# Altium schematic sheet M3_Coral.SchDoc
size A3; SheetNumber: 3; SheetTotal: 5
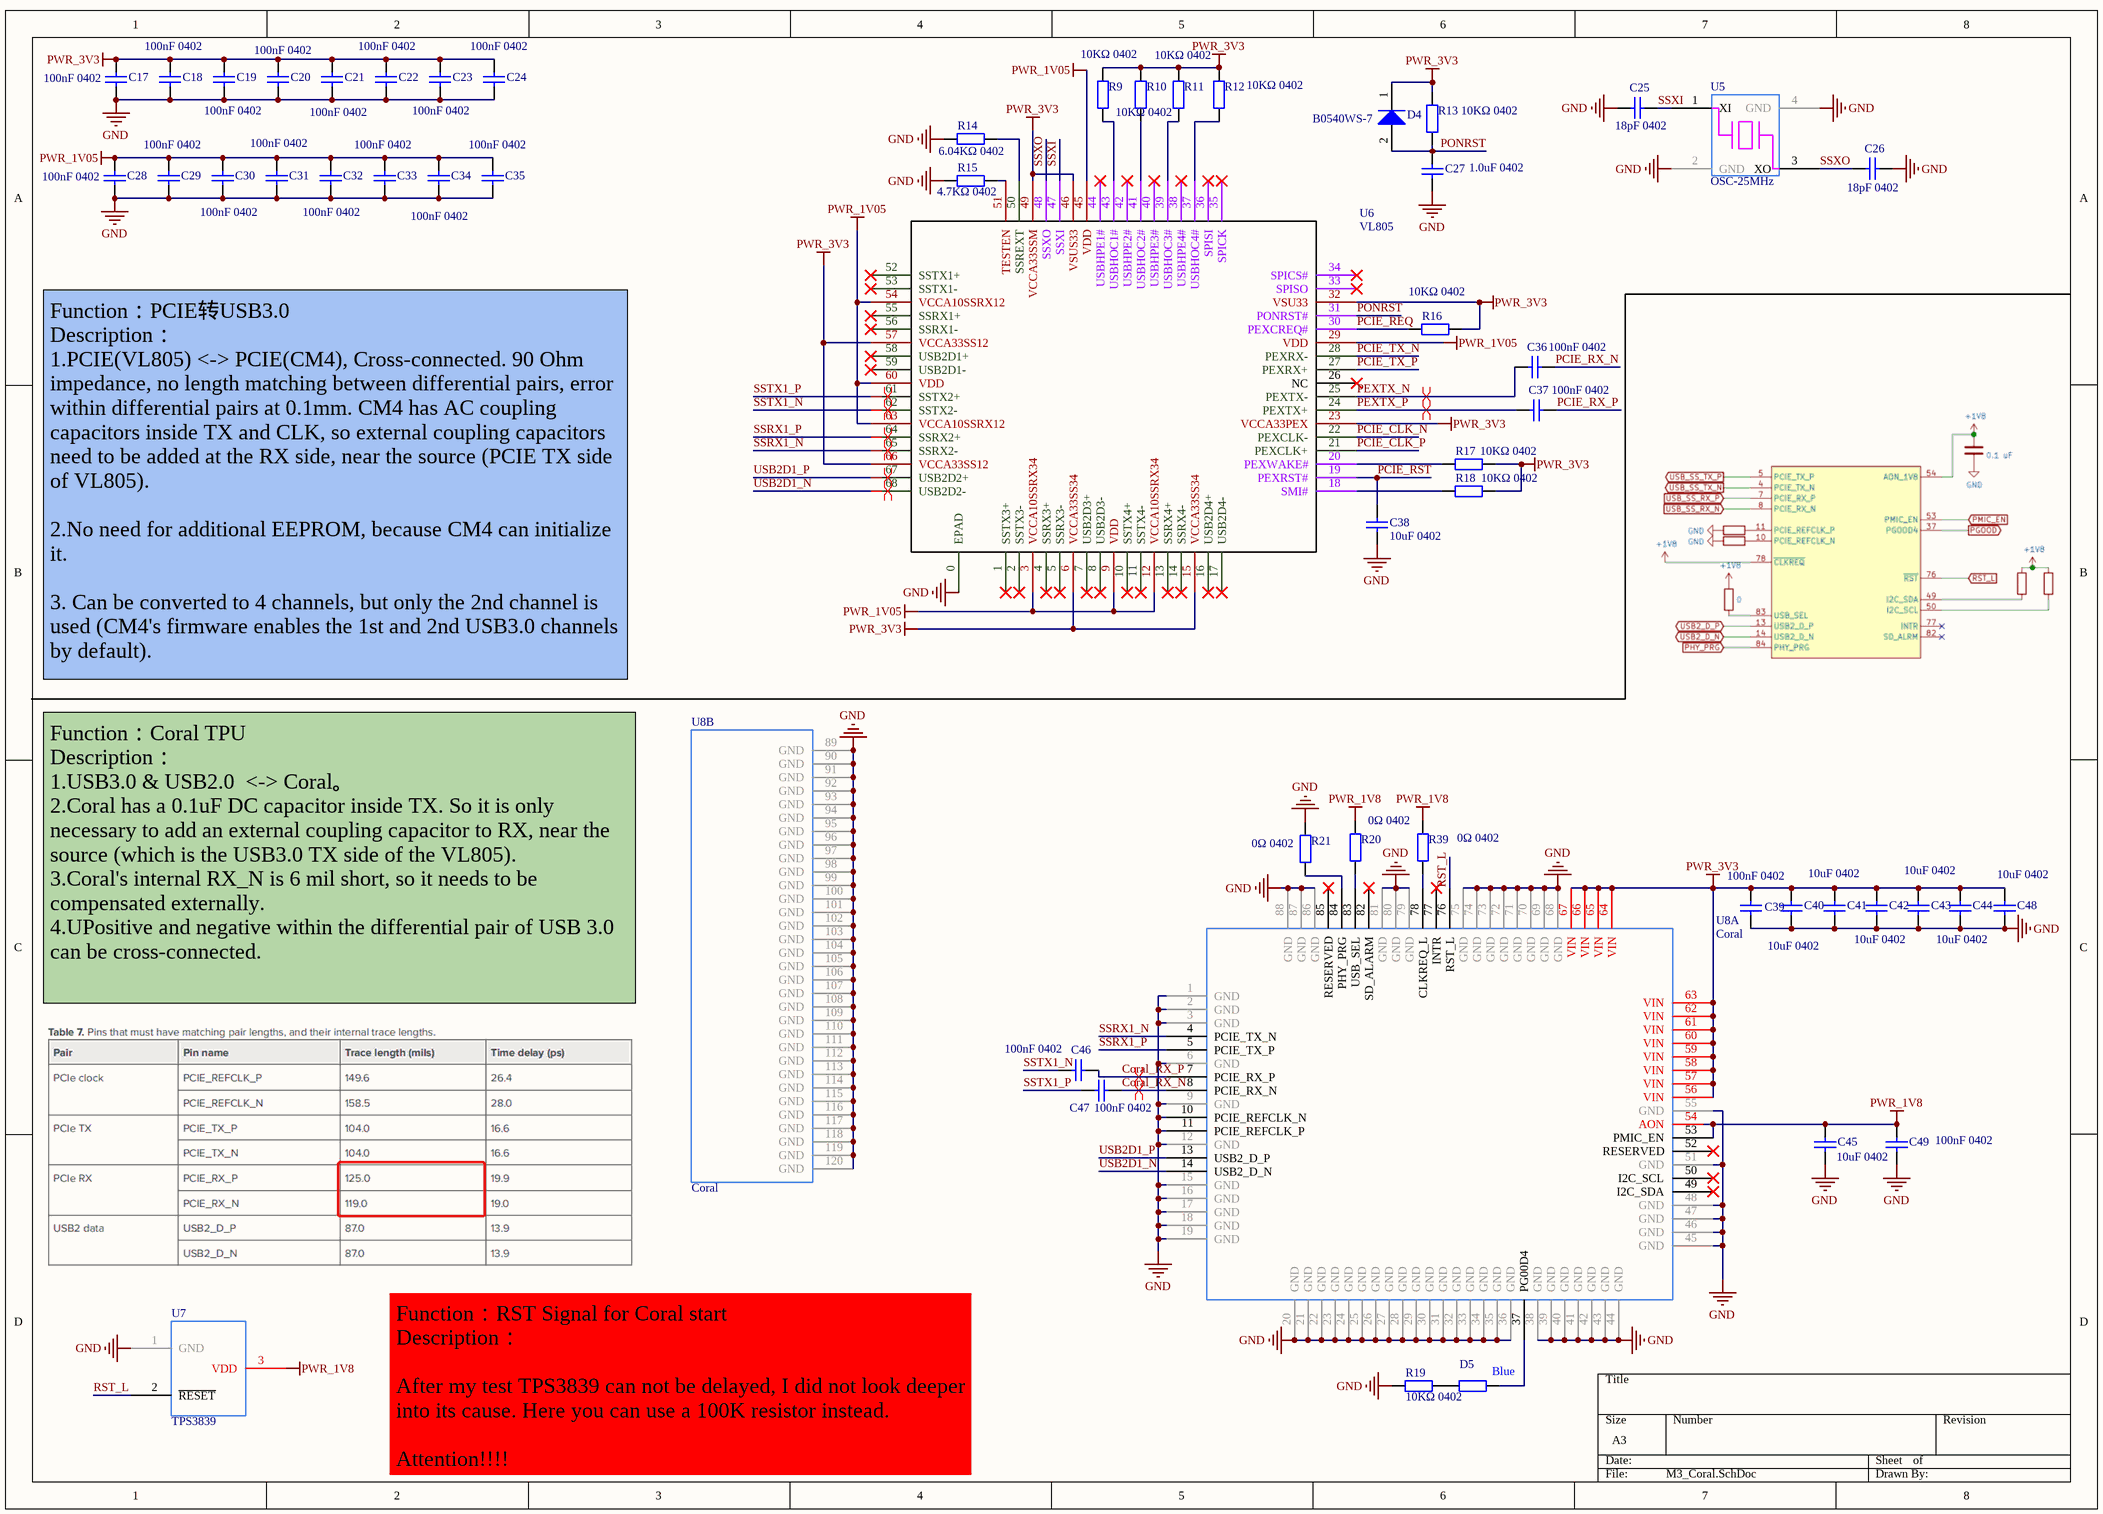
[diagram p0: M3_Coral.SchDoc]

## Parts
C17  100nF 0402  [0402_C]
C18  100nF 0402  [0402_C]
C19  100nF 0402  [0402_C]
C20  100nF 0402  [0402_C]
C21  100nF 0402  [0402_C]
C22  100nF 0402  [0402_C]
C23  100nF 0402  [0402_C]
C24  100nF 0402  [0402_C]
C25  18pF 0402  [0402_C]
C26  18pF 0402  [0402_C]
C27  1.0uF 0402  [0402_C]
C28  100nF 0402  [0402_C]
C29  100nF 0402  [0402_C]
C30  100nF 0402  [0402_C]
C31  100nF 0402  [0402_C]
C32  100nF 0402  [0402_C]
C33  100nF 0402  [0402_C]
C34  100nF 0402  [0402_C]
C35  100nF 0402  [0402_C]
C36  100nF 0402  [0402_C]
C37  100nF 0402  [0402_C]
C38  10uF 0402  [0402_C]
C39  100nF 0402  [0402_C]
C40  10uF 0402  [0402_C]
C41  10uF 0402  [0402_C]
C42  10uF 0402  [0402_C]
C43  10uF 0402  [0402_C]
C44  10uF 0402  [0402_C]
C45  10uF 0402  [0402_C]
C46  100nF 0402  [0402_C]
C47  100nF 0402  [0402_C]
C48  10uF 0402  [0402_C]
C49  100nF 0402  [0402_C]
D4  B0540WS-7  [B0540WS-7]
D5  Blue  [0402_R]
R9  10KΩ 0402  [0402_R]
R10  10KΩ 0402  [0402_R]
R11  10KΩ 0402  [0402_R]
R12  10KΩ 0402  [0402_R]
R13  10KΩ 0402  [0402_R]
R14  6.04KΩ 0402  [0402_R]
R15  4.7KΩ 0402  [0402_R]
R16  10KΩ 0402  [0402_R]
R17  10KΩ 0402  [0402_R]
R18  10KΩ 0402  [0402_R]
R19  10KΩ 0402  [0402_R]
R20  0Ω 0402  [0402_R]
R21  0Ω 0402  [0402_R]
R39  0Ω 0402  [0402_R]
U5  OSC-25MHz  [OSC-25MHz]
U6  VL805  [VL805]
U7  TPS3839  [TPS3839]
U8  Coral  [Coral]  (parts A,B of 2)

## Nets
GND: C17.1 C18.1 C19.1 C20.1 C21.1 C22.1 C23.1 C24.1 C25.1 C26.2 C27.2 C28.1 C29.1 C30.1 C31.1 C32.1 C33.1 C34.1 C35.1 C38.1 C39.1 C40.1 C41.1 C42.1 C43.1 C44.1 C45.1 C48.1 C49.1 R14.2 R15.2 R19.1 R21.2 U5.2(GND) U5.4(GND) U6.0(EPAD) U7.1(GND) U8.1(GND) U8.2(GND) U8.3(GND) U8.6(GND) U8.9(GND) U8.10(PCIE_REFCLK_N) U8.11(PCIE_REFCLK_P) U8.12(GND) U8.15(GND) U8.16(GND) U8.17(GND) U8.18(GND) U8.19(GND) U8.20(GND) U8.21(GND) U8.22(GND) U8.23(GND) U8.24(GND) U8.25(GND) U8.26(GND) U8.27(GND) U8.28(GND) U8.29(GND) U8.30(GND) U8.31(GND) U8.32(GND) U8.33(GND) U8.34(GND) U8.35(GND) U8.36(GND) U8.38(GND) U8.39(GND) U8.40(GND) U8.41(GND) U8.42(GND) U8.43(GND) U8.44(GND) U8.45(GND) U8.46(GND) U8.47(GND) U8.48(GND) U8.51(GND) U8.55(GND) U8.68(GND) U8.69(GND) U8.70(GND) U8.71(GND) U8.72(GND) U8.73(GND) U8.74(GND) U8.75(GND) U8.79(GND) U8.80(GND) U8.81(GND) U8.86(GND) U8.87(GND) U8.88(GND) U8.89(GND) U8.90(GND) U8.91(GND) U8.92(GND) U8.93(GND) U8.94(GND) U8.95(GND) U8.96(GND) U8.97(GND) U8.98(GND) U8.99(GND) U8.100(GND) U8.101(GND) U8.102(GND) U8.103(GND) U8.104(GND) U8.105(GND) U8.106(GND) U8.107(GND) U8.108(GND) U8.109(GND) U8.110(GND) U8.111(GND) U8.112(GND) U8.113(GND) U8.114(GND) U8.115(GND) U8.116(GND) U8.117(GND) U8.118(GND) U8.119(GND) U8.120(GND)
PWR_1V05: C28.2 C29.2 C30.2 C31.2 C32.2 C33.2 C34.2 C35.2 U6.3(VCCA10SSRX34) U6.9(VDD) U6.12(VCCA10SSRX34) U6.29(VDD) U6.45(VDD) U6.54(VCCA10SSRX12) U6.60(VDD) U6.63(VCCA10SSRX12)
PWR_1V8: C45.2 C49.2 R20.2 R39.2 U7.3(VDD) U8.53(PMIC_EN) U8.54(AON)
PWR_3V3: C17.2 C18.2 C19.2 C20.2 C21.2 C22.2 C23.2 C24.2 C39.2 C40.2 C41.2 C42.2 C43.2 C44.2 C48.2 D4.1(K) R9.2 R10.2 R11.2 R12.2 R13.2 R16.2 R17.2 R18.2 U6.6(VCCA33SS34) U6.15(VCCA33SS34) U6.23(VCCA33PEX) U6.32(VSU33) U6.46(VSUS33) U6.49(VCCA33SSM) U6.57(VCCA33SS12) U6.66(VCCA33SS12) U8.56(VIN) U8.57(VIN) U8.58(VIN) U8.59(VIN) U8.60(VIN) U8.61(VIN) U8.62(VIN) U8.63(VIN) U8.64(VIN) U8.65(VIN) U8.66(VIN) U8.67(VIN)
Coral_RX_N: C47.2 U8.8(PCIE_RX_N)
Coral_RX_P: C46.2 U8.7(PCIE_RX_P)
PCIE_CLK_N: U6.22(PEXCLK-)
PCIE_CLK_P: U6.21(PEXCLK+)
PCIE_REQ: R16.1 U6.30(PEXCREQ#)
PCIE_RST: C38.2 U6.19(PEXRST#)
PCIE_RX_N: C36.2
PCIE_RX_P: C37.2
PCIE_TX_N: U6.28(PEXRX-)
PCIE_TX_P: U6.27(PEXRX+)
PEXTX_N: C36.1 U6.25(PEXTX-)
PEXTX_P: C37.1 U6.24(PEXTX+)
PONRST: C27.1 D4.2(A) R13.1 U6.31(PONRST#)
RST_L: U7.2(~{RESET}) U8.76(RST_L)
SSRX1_N: U6.65(SSRX2-) U8.4(PCIE_TX_N)
SSRX1_P: U6.64(SSRX2+) U8.5(PCIE_TX_P)
SSTX1_N: C46.1 U6.62(SSTX2-)
SSTX1_P: C47.1 U6.61(SSTX2+)
SSXI: C25.2 U5.1(XI) U6.47(SSXI)
SSXO: C26.1 U5.3(XO) U6.48(SSXO)
USB2D1_N: U6.68(USB2D2-) U8.14(USB2_D_N)
USB2D1_P: U6.67(USB2D2+) U8.13(USB2_D_P)
NetD5_1: D5.1 R19.2
NetD5_2: D5.2 U8.37(PG00D4)
NetR9_1: R9.1 U6.43(USBHOC1#)
NetR10_1: R10.1 U6.41(USBHOC2#)
NetR11_1: R11.1 U6.39(USBHOC3#)
NetR12_1: R12.1 U6.37(USBHOC4#)
NetR14_1: R14.1 U6.50(SSREXT)
NetR15_1: R15.1 U6.51(TESTEN)
NetR17_1: R17.1 U6.20(PEXWAKE#)
NetR18_1: R18.1 U6.18(SMI#)
NetR20_1: R20.1 U8.83(USB_SEL)
NetR21_1: R21.1 U8.84(PHY_PRG)
NetR39_1: R39.1 U8.78(CLKREQ_L)

Not connected (* = marked no-connect by the designer): U6 1(SSTX3+)* 2(SSTX3-)* 4(SSRX3+)* 5(SSRX3-)* 7(USB2D3+)* 8(USB2D3-)* 10(SSTX4+)* 11(SSTX4-)* 13(SSRX4+)* 14(SSRX4-)* 16(USB2D4+)* 17(USB2D4-)* 26(NC)* 33(SPISO)* 34(SPICS#)* 35(SPICK)* 36(SPISI)* 38(USBHPE4#)* 40(USBHPE3#)* 42(USBHPE2#)* 44(USBHPE1#)* 52(SSTX1+)* 53(SSTX1-)* 55(SSRX1+)* 56(SSRX1-)* 58(USB2D1+)* 59(USB2D1-)*; U8 49(I2C_SDA)* 50(I2C_SCL)* 52(RESERVED)* 77(INTR)* 82(SD_ALARM)* 85(RESERVED)*

## Layout directives
differential pair: Coral_RX_N, Coral_RX_P, PEXTX_N, PEXTX_P, SSRX1_N, SSRX1_P, SSTX1_N, SSTX1_P, USB2D1_N, USB2D1_P

## Notes on the sheet
- Function：PCIE转USB3.0
  Description：
  1.PCIE(VL805) <-> PCIE(CM4), Cross-connected. 90 Ohm impedance, no length matching between differential pairs, error within differential pairs at 0.1mm. CM4 has AC coupling capacitors inside TX and CLK, so external coupling capacitors need to be added at the RX side, near the source (PCIE TX side of VL805).
  2.No need for additional EEPROM, because CM4 can initialize it.
  3. Can be converted to 4 channels, but only the 2nd channel is used (CM4's firmware enables the 1st and 2nd USB3.0 channels by default).
- Function：Coral TPU
  Description：
  1.USB3.0 & USB2.0  <-> Coral。
  2.Coral has a 0.1uF DC capacitor inside TX. So it is only necessary to add an external coupling capacitor to RX, near the source (which is the USB3.0 TX side of the VL805).
  3.Coral's internal RX_N is 6 mil short, so it needs to be compensated externally.
  4.UPositive and negative within the differential pair of USB 3.0 can be cross-connected.
- Function：RST Signal for Coral start
  Description：
  After my test TPS3839 can not be delayed, I did not look deeper into its cause. Here you can use a 100K resistor instead.
  Attention!!!!

## Library data of the parts
C17-C24 C28-C37 C39 C46 C47 C49 = 0402 100nF (104) 10% 16V: 贴片电容; ComponentLink1Description: 供应商链接; ComponentLink1URL: http://www.szlcsc.com/product/details_1877.html; Package: 0402; Supplier: LC; SuppliersPartNumber: C1525
C25 C26 = 0402 18pF (180) 5% 50V: 贴片电容; ComponentLink1Description: 供应商链接; ComponentLink1URL: http://www.szlcsc.com/product/details_1901.html; Package: 0402; Supplier: LC; SuppliersPartNumber: C1549
C27 = 0402 1.0uF (105) 10% 25V: 贴片电容; ComponentLink1Description: 供应商链接; ComponentLink1URL: http://www.szlcsc.com/product/details_53938.html; Package: 0402; Supplier: LC; SuppliersPartNumber: C52923
C38 C40-C45 C48 = 0402 10uF (106) 20% 6.3V: 贴片电容; ComponentLink1Description: 供应商链接; ComponentLink1URL: http://www.szlcsc.com/product/details_16204.html; Package: 0402; Supplier: LC; SuppliersPartNumber: C15525
D5 R9-R13 R16-R19 = 0402 10KΩ (1002) 1%: 贴片电阻; ComponentLink1Description: 供应商链接; ComponentLink1URL: http://www.szlcsc.com/product/details_26487.html; Package: 0402; Supplier: LC; SuppliersPartNumber: C25744
R14 = 0402 5.6KΩ (5601) 1%: 贴片电阻; ComponentLink1Description: 供应商链接; ComponentLink1URL: http://www.szlcsc.com/product/details_26651.html; Package: 0402; Supplier: LC; SuppliersPartNumber: C25908
R15 = 0402 4.7KΩ (4701) 1%: 贴片电阻; ComponentLink1Description: 供应商链接; ComponentLink1URL: http://www.szlcsc.com/product/details_26643.html; Package: 0402; Supplier: LC; SuppliersPartNumber: C25900
R20 R21 R39 = 0402 0Ω (0R0) 1%: 贴片电阻; ComponentLink1Description: 供应商链接; ComponentLink1URL: http://www.szlcsc.com/product/details_17853.html; Package: 0402; Supplier: LC; SuppliersPartNumber: C17168
U5 = OSC-25MHz: Passive crystal oscillator
U6 = VL805: PCIe to USB3.0
U7 = TPS3839: Delay 200 MS
U8 = Coral: G313-06329-00